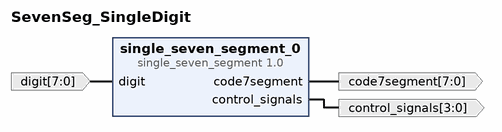
[diagram p0: block diagram of the top level]
# Vivado block design SevenSeg_SingleDigit, xc7a35tcpg236-1, Vivado 2025.1
create_bd_design SevenSeg_SingleDigit

create_bd_port -dir I -from 7 -to 0 -type data digit
create_bd_port -dir O -from 7 -to 0 -type data code7segment
create_bd_port -dir O -from 3 -to 0 -type data control_signals

create_bd_cell -type ip -vlnv xilinx.com:hls:single_seven_segment:1.0 single_seven_segment_0

# ---- connections ----

connect_bd_net -net digit_0_1 [get_bd_ports digit] [get_bd_pins single_seven_segment_0/digit]
connect_bd_net [get_bd_pins single_seven_segment_0/code7segment] [get_bd_ports code7segment]
connect_bd_net [get_bd_pins single_seven_segment_0/control_signals] [get_bd_ports control_signals]

validate_bd_design
save_bd_design
